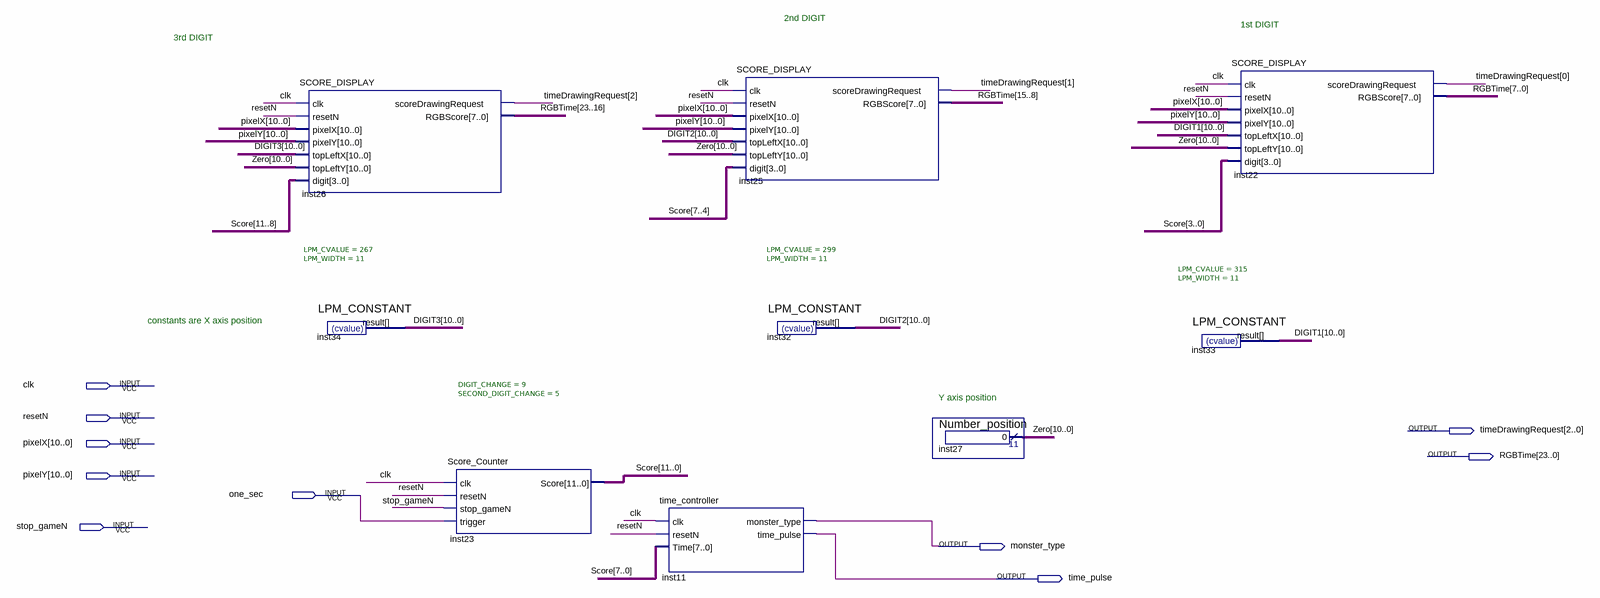
[diagram p0: schematic sheet]
// Quartus schematic TIME_TOP.bdf as structural Verilog: 9 symbols, 10 pins
module TIME_TOP (
  input  clk,
  input  resetN,
  input  [10:0] pixelX,
  input  [10:0] pixelY,
  input  one_sec,
  input  stop_gameN,
  output [2:0] timeDrawingRequest,
  output [23:0] RGBTime,
  output monster_type,
  output time_pulse
);

  wire [10:0] DIGIT1, DIGIT2, DIGIT3, Zero;
  wire [11:0] Score;

  SCORE_DISPLAY inst26 (
    .clk(clk), .resetN(resetN), .pixelX(pixelX), .pixelY(pixelY), .topLeftX(DIGIT3), .topLeftY(Zero),
    .digit(Score[11:8]), .scoreDrawingRequest(timeDrawingRequest[2]), .RGBScore(RGBTime[23:16]));
  LPM_CONSTANT #(.LPM_CVALUE(267), .LPM_WIDTH(11)) inst34 (.result(DIGIT3));
  Score_Counter #(.DIGIT_CHANGE(9), .SECOND_DIGIT_CHANGE(5)) inst23 (
    .clk(clk), .resetN(resetN), .stop_gameN(stop_gameN), .trigger(one_sec), .Score(Score));
  time_controller inst11 (
    .clk(clk), .resetN(resetN), .Time(Score[7:0]), .monster_type(monster_type), .time_pulse(time_pulse));
  SCORE_DISPLAY inst25 (
    .clk(clk), .resetN(resetN), .pixelX(pixelX), .pixelY(pixelY), .topLeftX(DIGIT2), .topLeftY(Zero),
    .digit(Score[7:4]), .scoreDrawingRequest(timeDrawingRequest[1]), .RGBScore(RGBTime[15:8]));
  LPM_CONSTANT #(.LPM_CVALUE(299), .LPM_WIDTH(11)) inst32 (.result(DIGIT2));
  Number_position inst27 (.result(Zero));
  SCORE_DISPLAY inst22 (
    .clk(clk), .resetN(resetN), .pixelX(pixelX), .pixelY(pixelY), .topLeftX(DIGIT1), .topLeftY(Zero),
    .digit(Score[3:0]), .scoreDrawingRequest(timeDrawingRequest[0]), .RGBScore(RGBTime[7:0]));
  LPM_CONSTANT #(.LPM_CVALUE(315), .LPM_WIDTH(11)) inst33 (.result(DIGIT1));

  // Notes on the sheet:
  //   2nd DIGIT
  //   1st DIGIT
  //   3rd DIGIT
  //   constants are X axis position
  //   Y axis position
endmodule
